# Altium schematic sheet USBToTTL.SchDoc
size A4; SheetNumber: 2; SheetTotal: 4
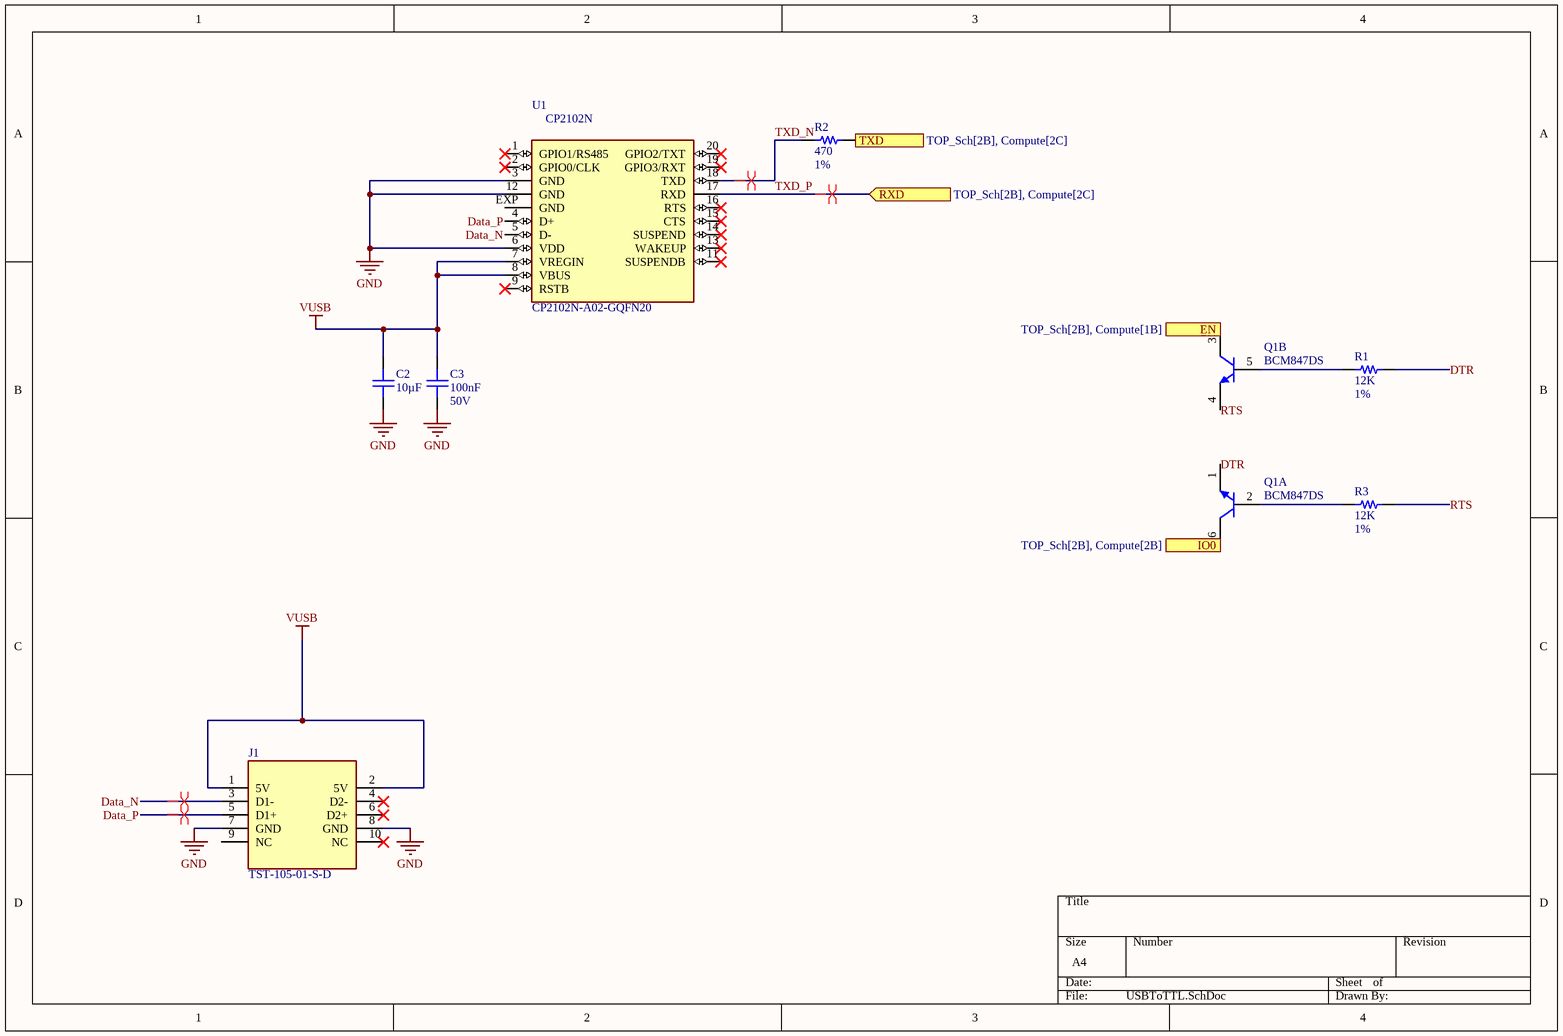
[diagram p0: USBToTTL.SchDoc]

## Parts
C2  value 10µF  [FP-GRM188-0_2-IPC_B]  (hidden comment: GRM188R61E106MA73J)
C3  value 100nF  Voltage Rating: 50V  [CAPC1608X90X35LL15T15]  (hidden comment: 06035C104KAT4A)
J1  TST-105-01-S-D  [TST-105-01-S-D-Footprint-1]
Q1  BCM847DS  [SOT95P275X110-6N]  (parts A,B of 2)
R1  value 12K  Tolerance: 1%  [RESC1608X06L 0603 High Density]  (hidden comment: RC0603FR-0718KL)
R2  value 470  Tolerance: 1%  [RESC1608X06L 0603 High Density]  (hidden comment: RC0603FR-07470RL)
R3  value 12K  Tolerance: 1%  [RESC1608X06L 0603 High Density]  (hidden comment: RC0603FR-0718KL)
U1  CP2102N-A02-GQFN20  [WFQFN-20]

## Ports
EN (in, see TOP_Sch[2B], Compute[1B]), IO0 (in, see TOP_Sch[2B], Compute[2B]), RXD (in, see TOP_Sch[2B], Compute[2C]), TXD (out, see TOP_Sch[2B], Compute[2C])

## Nets
GND: C2.1 C3.1 J1.7(GND) J1.8(GND) U1.3(GND) U1.6(VDD) U1.12(GND)
VUSB: C2.2 C3.2 J1.1(5V) J1.2(5V) U1.7(VREGIN) U1.8(VBUS)
Data_N: J1.3(D1-) U1.5(D-)
Data_P: J1.5(D1+) U1.4(D+)
DTR: Q1.1(E) R1.2
EN: Q1.3(C) ; port EN
IO0: Q1.6(C) ; port IO0
RTS: Q1.4(E) R3.2
TXD: R2.2 ; port TXD
TXD_N: R2.1 U1.18(TXD)
TXD_P: U1.17(RXD) ; port RXD
NetQ1_2: Q1.2(B) R3.1
NetQ1_5: Q1.5(B) R1.1

Not connected (* = marked no-connect by the designer): J1 4(D2-)* 6(D2+)* 9(NC) 10(NC)*; U1 1(GPIO1/RS485)* 2(GPIO0/CLK)* 9(RSTB)* 11(SUSPENDB)* 13(WAKEUP)* 14(SUSPEND)* 15(CTS)* 16(RTS)* 19(GPIO3/RXT)* 20(GPIO2/TXT)* EXP(GND)

## Layout directives
differential pair: Data_N
differential pair; differential pair class USB: Data_P
differential pair; differential pair class TTL: TXD_N, TXD_P

## Notes on the sheet
- (in symbol CP2102N-A02-GQFN20) CP2102N

## Library data of the parts
C2 = CMP-001-00049-1: Ceramic Capacitor, Multilayer, Ceramic, 25V, 20% +Tol, 20% -Tol, X5R, 15% TC, 10uF, Surface Mount, 0603; Multilayer: Yes; Height: 0.8mm; JESD-609 Code: e3; Rated DC Voltage (URdc): 25V; RoHS Compliant: Yes; Pins: 2; Tolerance (fill in as +-): 20%; Temperature Characteristics Code: X5R; Length: 1.6mm; Case/Package: 0603; Mounting Technology: Surface Mount; Termination: Wraparound; Package Shape: Rectangular; Reach SVHC Compliant: Yes; Dielectric Material: Ceramic; Terminal Finish: Nickel; Max Operating Temperature: 85°C; Capacitor Type: Ceramic; Packaging: Tape and Reel; Min Operating Temperature: -55°C; Package Style: SMTMeter; Tolerance  (fill in as +-): 20%; Width: 0.8mm
C3 = CMP-001-00048-2: Ceramic Capacitor, Multilayer, Ceramic, 50V, 10% +Tol, 10% -Tol, X7R, 15% TC, 0.1uF, Surface Mount, 0603; Multilayer: Yes; Capacitance: 100 nF; Temperature Characteristics Code: X7R; Length: 1.6mm; Height: 0.9mm; Packaging: Tape and Reel; Tolerance: 10%; Mounting Technology: Surface Mount; Rated DC Voltage (URdc): 50V; Package Style: SMTMeter; Tolerance (fill in as +-): 10%; RoHS Compliant: Yes; Min Operating Temperature: -55°C; Capacitor Type: Ceramic; JESD-609 Code: e3; Terminal Finish: Nickel; Max Operating Temperature: 125°C; Pins: 2; Tolerance  (fill in as +-): 10%; Width: 0.81mm; Termination: Wraparound; Reach SVHC Compliant: Yes; Dielectric Material: Ceramic; Package Shape: Rectangular; Case/Package: 0603
J1 = CMP-002-00096-2: Board Connector, 10 Contact(s), 2 Row(s), Male, Straight, 0.1 inch Pitch, Solder Terminal, Locking, Black Insulator, Receptacle; RoHS Compliant: Yes; Mounting Technology: Board; Max Operating Temperature: 125°C; Connector Type: BOARD CONNECTOR; Min Operating Temperature: -55°C
Q1 = CMP-011-000000-2: Trans GP BJT NPN 45V 0.1A 6-Pin TSOP T/R; Manufacturer 1: NXP Semiconductors; Manufacturer Part Number 1: BCM847DS,135; Power Dissipation: 380mW; Collector Base Voltage (VCBO): 50V; Transition Frequency: 250MHz; Max Collector Current: 100mA; Element Configuration: Dual; Emitter Base Voltage (VEBO): 6V; Number of Elements: 2; Max Operating Temperature: 150°C; Collector Emitter Breakdown Voltage: 45V; ComponentLink4URL: https://datasheet.ciiva.com/968/bcm847bv-bs-ds-968730.pdf?src-supplier=Digi-Key; ComponentLink1Description: https://datasheet.ciiva.com/4725/bcm847bv-bs-ds-188878-4725172.pdf?src-supplier=Mouser; Min Operating Temperature: -65°C; Package Quantity: 1; ComponentLink5Description: https://datasheet.ciiva.com/11204/bcm847bv-bs-ds-11204107.pdf?src-supplier=Avnet; Collector Emitter Voltage (VCEO): 45V; Case/Package: TSOP; Design Item ID: BCM847DS; Gain Bandwidth Product: 250MHz; ComponentLink3URL: https://datasheet.ciiva.com/968/bcm847bv-bs-ds-968729.pdf?src-supplier=Digi-Key; Mount: Surface Mount; Max Breakdown Voltage: 45V; ComponentLink1URL: https://datasheet.ciiva.com/4725/bcm847bv-bs-ds-188878-4725172.pdf?src-supplier=Mouser; Contact Plating: Tin; Stock 1: 7614; Source: SiCeff_Parameter_V2.SCHLIB; ComponentLink2URL: https://datasheet.ciiva.com/968/bcm847bv-bs-ds-968728.pdf?src-supplier=Digi-Key; Number of Pins: 6; RoHS: Yes; ComponentLink5URL: https://datasheet.ciiva.com/11204/bcm847bv-bs-ds-11204107.pdf?src-supplier=Avnet; ComponentLink2Description: https://datasheet.ciiva.com/968/bcm847bv-bs-ds-968728.pdf?src-supplier=Digi-Key; Category: BJTs; Max Power Dissipation: 380mW; Pin Count: 6; ComponentLink3Description: https://datasheet.ciiva.com/968/bcm847bv-bs-ds-968729.pdf?src-supplier=Digi-Key; Component Type: Standard; Pricing 1: 1=0,43000, 10=0,32700, 25=0,29520, 100=0,15560, 250=0,15396, 500=0,13788, 1000=0,10730, 2500=0,09818, 5000=0,09389 (USD); Frequency: 250MHz; ComponentLink4Description: https://datasheet.ciiva.com/968/bcm847bv-bs-ds-968730.pdf?src-supplier=Digi-Key; Packaging: Tape and Reel; Radiation Hardening: No; Polarity: NPN
R1 R3 = CMP-009-00172-1: SMD Chip Resistor, 18 kOhm, ± 1%, 100 mW, 0603 [1608 Metric], Thick Film, General Purpose; Power: 100mW; Temperature Coefficient: 100ppm/°C; Voltage Rating: 75V; Max Operating Temperature: 155°C; Mounting Technology: Surface Mount; Case/Package: 0603; RoHS Compliant: Yes; Depth: 0.8mm; Height: 0.45mm; Min Operating Temperature: -55°C; Length: 1.6mm; Pins: 2
R2 = CMP-009-00156-1: Res Thick Film 0603 470 Ohm 1% 0.1W(1/10W) ±100ppm/C Pad SMD T/R; Voltage Rating: 50V; Power: 100mW; Temperature Coefficient: 100ppm/°C; Min Operating Temperature: -55°C; Depth: 0.8mm; Max Operating Temperature: 155°C; Length: 0.063inch; Pins: 2; Case/Package: 0603; Mounting Technology: Surface Mount; Height: 0.022inch; RoHS Compliant: Yes
U1 = CP2102N-A02-GQFN20: USB Bridge, USB to UART USB 2.0 UART Interface 20-QFN (3x3); MF: Silicon Labs; Package: WFQFN-20 Silicon Labs; Price: None; Check_prices: https://www.snapeda.com/parts/CP2102N-A02-GQFN20/Silicon+Labs/view-part/?ref=eda; Value: *; SnapEDA_Link: https://www.snapeda.com/parts/CP2102N-A02-GQFN20/Silicon+Labs/view-part/?ref=snap; MP: CP2102N-A02-GQFN20; Availability: In Stock; Purchase-URL: https://pricing.snapeda.com/search/part/CP2102N-A02-GQFN20/?ref=eda